# EAGLE schematic Funkschalter1V0.1 (EAGLE 9.0.0)
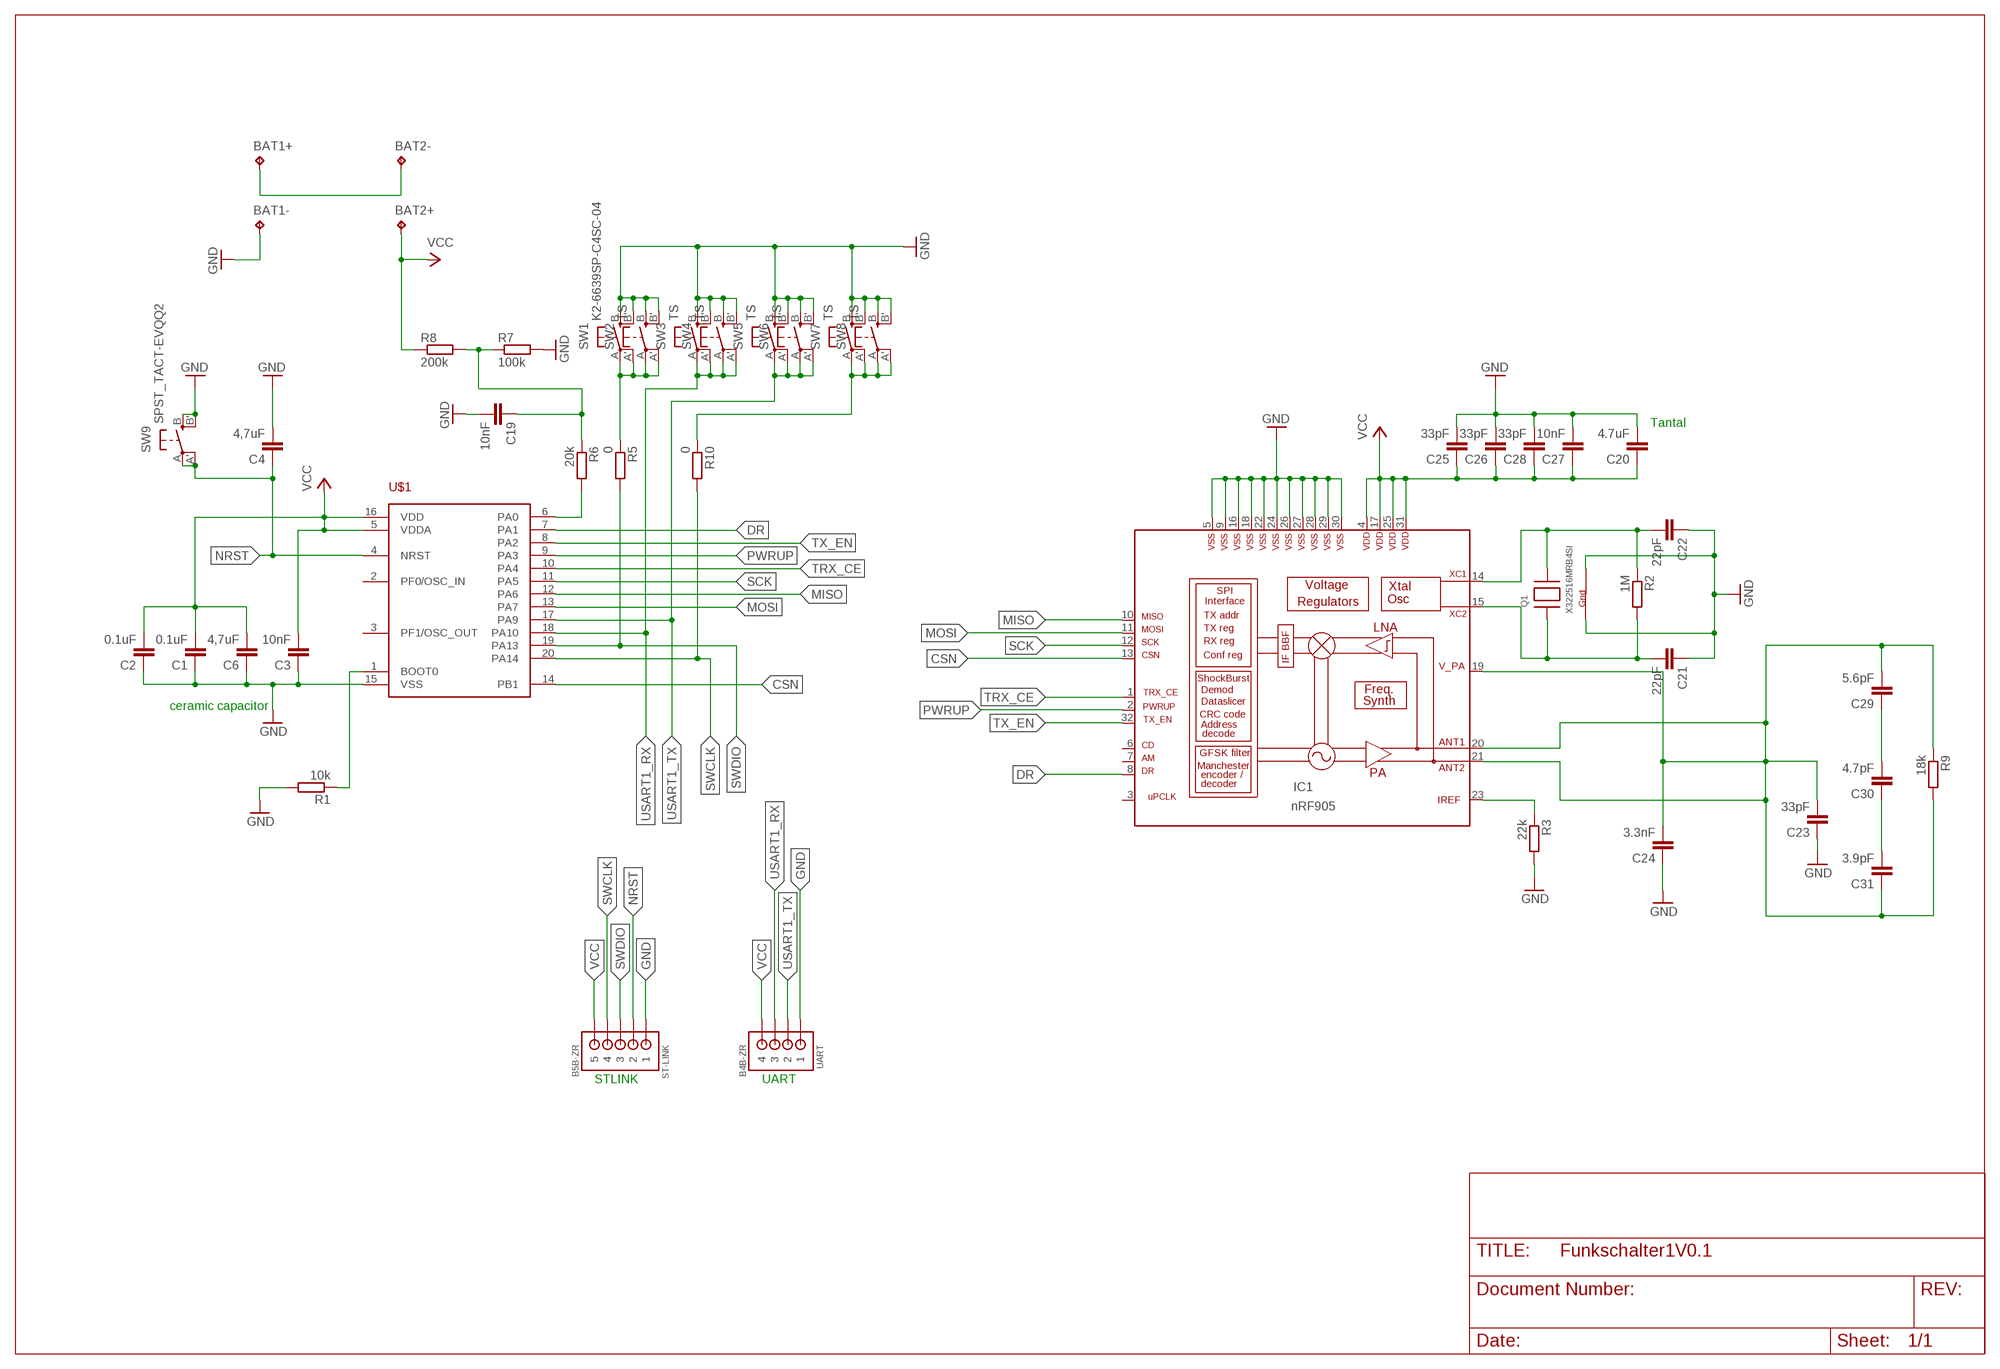
[diagram p0: schematic, sheet 1]

## Parts
BAT1+  TPTP20R  [TP20R]
BAT1-  TPTP20R  [TP20R]
BAT2+  TPTP20R  [TP20R]
BAT2-  TPTP20R  [TP20R]
C1  0.1uF  C-EUC0603  [C0603]
C2  0.1uF  C-EUC0603  [C0603]
C3  10nF  C-EUC0603  [C0603]
C4  4,7uF  C-EUC0603  [C0603]
C6  4,7uF  C-EUC0603  [C0603]
C19  10nF  C-EUC0603  [C0603]
C20  4.7uF  C-EUC0603  [C0603]
C21  22pF  C-EUC0603  [C0603]
C22  22pF  C-EUC0603  [C0603]
C23  33pF  C-EUC0603  [C0603]
C24  3.3nF  C-EUC0603  [C0603]
C25  33pF  C-EUC0603  [C0603]
C26  33pF  C-EUC0603  [C0603]
C27  10nF  C-EUC0603  [C0603]
C28  33pF  C-EUC0603  [C0603]
C29  5.6pF  C-EUC0603  [C0603]
C30  4.7pF  C-EUC0603  [C0603]
C31  3.9pF  C-EUC0603  [C0603]
IC1  nRF905  NRF905QFN32_5X5MM  [QFN32-5X5MM]
Q1  X322516MRB4SI  XTAL-4-3225  [NX3225]
R1  10k  R-EU_R0603  [R0603]
R2  1M  R-EU_R0603  [R0603]
R3  22k  R-EU_R0603  [R0603]
R5  0  R-EU_R0603  [R0603]
R6  20k  R-EU_R0603  [R0603]
R7  100k  R-EU_R0603  [R0603]
R8  200k  R-EU_R0603  [R0603]
R9  18k  R-EU_R0603  [R0603]
R10  0  R-EU_R0603  [R0603]
ST-LINK  B5B-ZR  [B5B-ZR]
SW1  K2-6639SP-C4SC-04  SPST_TACT-EVQQ2  [EVQ-Q2]
SW2  TS  SPST_TACT-EVQQ2  [EVQ-Q2]
SW3  TS  SPST_TACT-EVQQ2  [EVQ-Q2]
SW4  TS  SPST_TACT-EVQQ2  [EVQ-Q2]
SW5  TS  SPST_TACT-EVQQ2  [EVQ-Q2]
SW6  TS  SPST_TACT-EVQQ2  [EVQ-Q2]
SW7  TS  SPST_TACT-EVQQ2  [EVQ-Q2]
SW8  TS  SPST_TACT-EVQQ2  [EVQ-Q2]
SW9  SPST_TACT-EVQQ2  [EVQ-Q2]
U$1  STM32F030F4  [TSSOP20]
UART  B4B-ZR  [B4B-ZR]

## Nets
CSN: IC1.13(CSN) U$1.14(PB1)
DR: IC1.8(DR) U$1.7(PA1)
GND: BAT1-.TP C1.1 C2.1 C3.1 C4.2 C6.1 C19.2 C20.2 C21.1 C22.1 C23.1 C24.1 C25.2 C26.2 C27.2 C28.2 IC1.5(VSS5) IC1.9(VSS9) IC1.16(VSS16) IC1.18(VSS18) IC1.22(VSS22) IC1.24(VSS24) IC1.26(VSS26) IC1.27(VSS27) IC1.28(VSS28) IC1.29(VSS29) IC1.30(VSS30) Q1.2(G2) Q1.4(G1) R1.2 R3.2 R7.2 ST-LINK.1 SW1.B'(S1) SW1.B(S) SW2.B'(S1) SW2.B(S) SW3.B'(S1) SW3.B(S) SW4.B'(S1) SW4.B(S) SW5.B'(S1) SW5.B(S) SW6.B'(S1) SW6.B(S) SW7.B'(S1) SW7.B(S) SW8.B'(S1) SW8.B(S) SW9.B'(S1) SW9.B(S) U$1.15(VSS) UART.1
MISO: IC1.10(MISO) U$1.12(PA6)
MOSI: IC1.11(MOSI) U$1.13(PA7)
N$1: R5.1 SW1.A'(P1) SW1.A(P) SW2.A'(P1) SW2.A(P)
N$2: R1.1 U$1.1(BOOT0)
N$3: R6.2 U$1.6(PA0)
N$4: R10.1 SW7.A'(P1) SW7.A(P) SW8.A'(P1) SW8.A(P)
N$5: BAT1+.TP BAT2-.TP
N$9: C19.1 R6.1 R7.1 R8.2
N$12: C21.2 IC1.15(XC2) Q1.1(X1) R2.2
N$13: C22.2 IC1.14(XC1) Q1.3(X2) R2.1
N$16: IC1.23(IREF) R3.1
N$18: C23.2 C24.2 C29.2 C31.1 IC1.19(VDD_PA) IC1.20(ANT1) IC1.21(ANT2) R9.1 R9.2
N$19: C30.1 C31.2
N$20: C29.1 C30.2
NRST: C4.1 ST-LINK.2 SW9.A'(P1) SW9.A(P) U$1.4(NRST)
PWRUP: IC1.2(PWR_UP) U$1.9(PA3)
SCK: IC1.12(SCK) U$1.11(PA5)
SWCLK: R10.2 ST-LINK.4 U$1.20(PA14)
SWDIO: R5.2 ST-LINK.3 U$1.19(PA13)
TRX_CE: IC1.1(TRX_CE) U$1.10(PA4)
TX_EN: IC1.32(TX_EN) U$1.8(PA2)
USART1_RX: SW3.A'(P1) SW3.A(P) SW4.A'(P1) SW4.A(P) U$1.18(PA10) UART.3
USART1_TX: SW5.A'(P1) SW5.A(P) SW6.A'(P1) SW6.A(P) U$1.17(PA9) UART.2
VCC: BAT2+.TP C1.2 C2.2 C3.2 C6.2 C20.1 C25.1 C26.1 C27.1 C28.1 IC1.4(VDD4) IC1.17(VDD17) IC1.25(VDD25) IC1.31(DVDD1V2) R8.1 ST-LINK.5 U$1.5(VDDA) U$1.16(VDD) UART.4
Unconnected: IC1.3(UPCLK) IC1.6(CD) IC1.7(AM) U$1.2(PF0/OSC_IN) U$1.3(PF1/OSC_OUT)

## Notes on the sheet
- Tantal
- ceramic capacitor
- STLINK | UART

## Library data of the parts
BAT1+ BAT1- BAT2+ BAT2- = testpad:TP: Test pad
C1-C4 C6 C19-C31 = rcl:C-EU: CAPACITOR, European symbol; SPICEPREFIX: C
IC1 = nordic-semi:NRF905: RF TRANSCEIVER
Q1 = adafruit:XTAL-4: Classic 4-pin 3.2 x 2.5mm crystal
R1-R3 R5-R10 = rcl:R-EU_: RESISTOR, European symbol; SPICEPREFIX: R
ST-LINK = jst:B5B-ZR: JST-ZH Connector 5 pol, 1.5mm pitch Package: B5B-ZR Source: http://www.jst-mfg.com/product/pdf/eng/eZH.pdf
SW1-SW9 = adafruit:SPST_TACT: SMT 6mm switch, EVQQ2 series http://www.ladyada.net/library/eagle
U$1 = stm32f030f4:STM32F030F4
UART = jst:B4B-ZR: JST-ZH Connector 4 pol, 1.5mm pitch Package: B4B-ZR Source: http://www.jst-mfg.com/product/pdf/eng/eZH.pdf